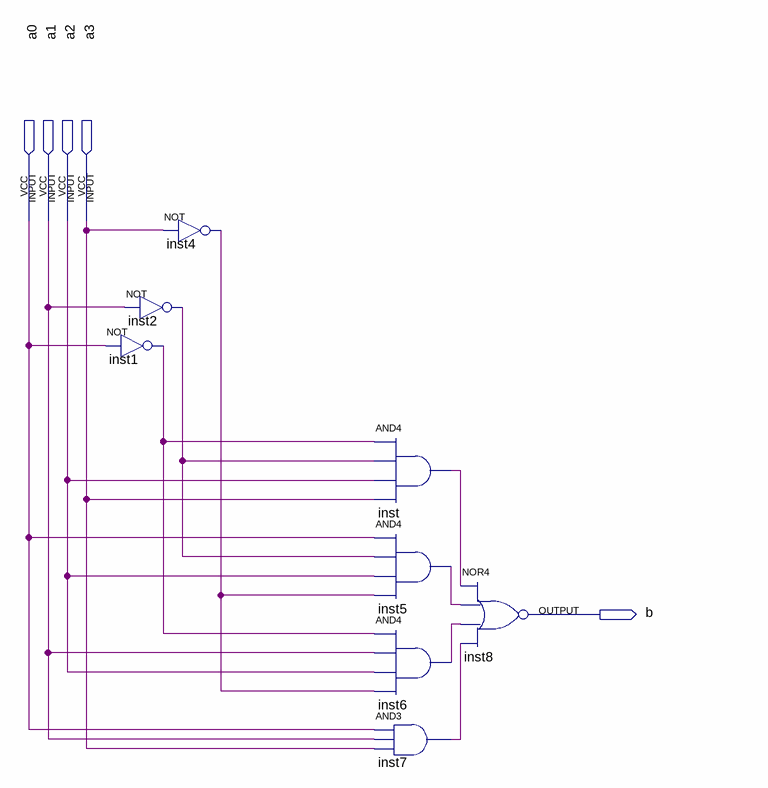
[diagram p0: schematic sheet]
// Quartus schematic B.bdf as structural Verilog: 8 symbols, 5 pins
module B (
  input  a0,
  input  a1,
  input  a2,
  input  a3,
  output b
);

  wire inst1_out, inst2_out, inst4_out, inst5_out, inst6_out, inst7_out, inst_out;

  not inst4 (inst4_out, a3);
  not inst2 (inst2_out, a1);
  not inst1 (inst1_out, a0);
  and inst (inst_out, inst1_out, inst2_out, a2, a3);
  and inst5 (inst5_out, a0, inst2_out, a2, inst4_out);
  and inst6 (inst6_out, inst1_out, a1, a2, inst4_out);
  and inst7 (inst7_out, a0, a1, a3);
  nor inst8 (b, inst_out, inst5_out, inst6_out, inst7_out);
endmodule
